# EAGLE schematic AnalogIn_Teensy_V10 (EAGLE 7.7.0)
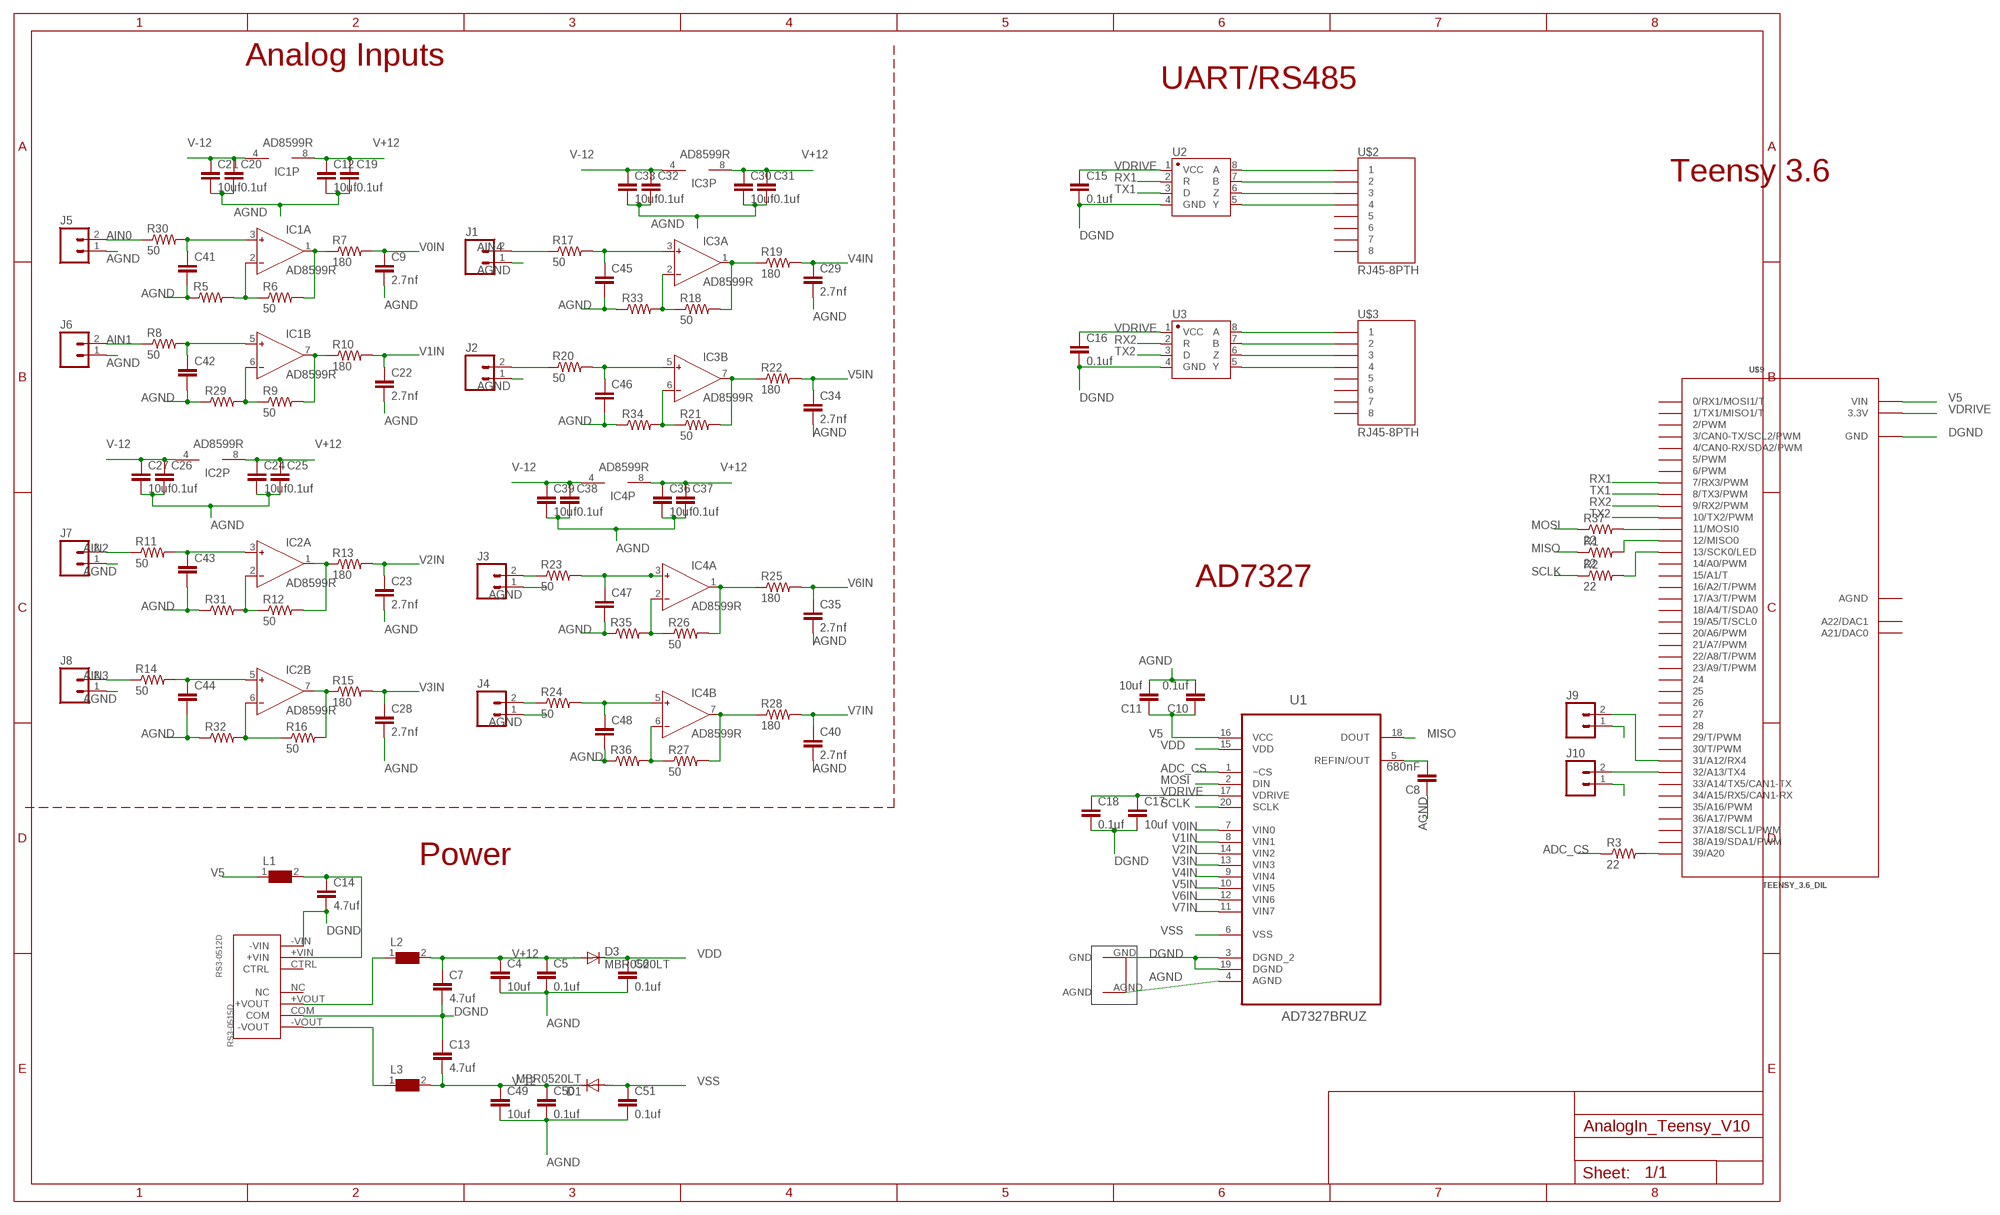
[diagram p0: schematic, sheet 1]

## Parts
C4  10uf  CAP0603-CAP  [0603-CAP]
C5  0.1uf  CAP0603-CAP  [0603-CAP]
C6  0.1uf  CAP0603-CAP  [0603-CAP]
C7  4.7uf  CAP0603-CAP  [0603-CAP]
C8  680nF  CAP0603-CAP  [0603-CAP]
C9  2.7nf  CAP0603-CAP  [0603-CAP]
C10  0.1uf  CAP0603-CAP  [0603-CAP]
C11  10uf  CAP0603-CAP  [0603-CAP]
C12  10uf  CAP0603-CAP  [0603-CAP]
C13  4.7uf  CAP0603-CAP  [0603-CAP]
C14  4.7uf  CAP0603-CAP  [0603-CAP]
C15  0.1uf  CAP0603-CAP  [0603-CAP]
C16  0.1uf  CAP0603-CAP  [0603-CAP]
C17  10uf  CAP0603-CAP  [0603-CAP]
C18  0.1uf  CAP0603-CAP  [0603-CAP]
C19  0.1uf  CAP0603-CAP  [0603-CAP]
C20  0.1uf  CAP0603-CAP  [0603-CAP]
C21  10uf  CAP0603-CAP  [0603-CAP]
C22  2.7nf  CAP0603-CAP  [0603-CAP]
C23  2.7nf  CAP0603-CAP  [0603-CAP]
C24  10uf  CAP0603-CAP  [0603-CAP]
C25  0.1uf  CAP0603-CAP  [0603-CAP]
C26  0.1uf  CAP0603-CAP  [0603-CAP]
C27  10uf  CAP0603-CAP  [0603-CAP]
C28  2.7nf  CAP0603-CAP  [0603-CAP]
C29  2.7nf  CAP0603-CAP  [0603-CAP]
C30  10uf  CAP0603-CAP  [0603-CAP]
C31  0.1uf  CAP0603-CAP  [0603-CAP]
C32  0.1uf  CAP0603-CAP  [0603-CAP]
C33  10uf  CAP0603-CAP  [0603-CAP]
C34  2.7nf  CAP0603-CAP  [0603-CAP]
C35  2.7nf  CAP0603-CAP  [0603-CAP]
C36  10uf  CAP0603-CAP  [0603-CAP]
C37  0.1uf  CAP0603-CAP  [0603-CAP]
C38  0.1uf  CAP0603-CAP  [0603-CAP]
C39  10uf  CAP0603-CAP  [0603-CAP]
C40  2.7nf  CAP0603-CAP  [0603-CAP]
C41  CAP0603-CAP  [0603-CAP]
C42  CAP0603-CAP  [0603-CAP]
C43  CAP0603-CAP  [0603-CAP]
C44  CAP0603-CAP  [0603-CAP]
C45  CAP0603-CAP  [0603-CAP]
C46  CAP0603-CAP  [0603-CAP]
C47  CAP0603-CAP  [0603-CAP]
C48  CAP0603-CAP  [0603-CAP]
C49  10uf  CAP0603-CAP  [0603-CAP]
C50  0.1uf  CAP0603-CAP  [0603-CAP]
C51  0.1uf  CAP0603-CAP  [0603-CAP]
D1  MBR0520LT  [SOD123]
D3  MBR0520LT  [SOD123]
IC1  AD8599R  [SO8]
IC2  AD8599R  [SO8]
IC3  AD8599R  [SO8]
IC4  AD8599R  [SO8]
J1  M023.5MM  [SCREWTERMINAL-3.5MM-2]
J2  M023.5MM  [SCREWTERMINAL-3.5MM-2]
J3  M023.5MM  [SCREWTERMINAL-3.5MM-2]
J4  M023.5MM  [SCREWTERMINAL-3.5MM-2]
J5  M023.5MM  [SCREWTERMINAL-3.5MM-2]
J6  M023.5MM  [SCREWTERMINAL-3.5MM-2]
J7  M023.5MM  [SCREWTERMINAL-3.5MM-2]
J8  M023.5MM  [SCREWTERMINAL-3.5MM-2]
J9  M023.5MM  [SCREWTERMINAL-3.5MM-2]
J10  M023.5MM  [SCREWTERMINAL-3.5MM-2]
L1  WE-CBF-742792118_1206  [1206]
L2  WE-CBF-742792118_1206  [1206]
L3  WE-CBF-742792118_1206  [1206]
R1  22  RESISTOR0603  [0603-RES]
R2  22  RESISTOR0603  [0603-RES]
R3  22  RESISTOR0603  [0603-RES]
R5  RESISTOR0603  [0603-RES]
R6  50  RESISTOR0603  [0603-RES]
R7  180  RESISTOR0603  [0603-RES]
R8  50  RESISTOR0603  [0603-RES]
R9  50  RESISTOR0603  [0603-RES]
R10  180  RESISTOR0603  [0603-RES]
R11  50  RESISTOR0603  [0603-RES]
R12  50  RESISTOR0603  [0603-RES]
R13  180  RESISTOR0603  [0603-RES]
R14  50  RESISTOR0603  [0603-RES]
R15  180  RESISTOR0603  [0603-RES]
R16  50  RESISTOR0603  [0603-RES]
R17  50  RESISTOR0603  [0603-RES]
R18  50  RESISTOR0603  [0603-RES]
R19  180  RESISTOR0603  [0603-RES]
R20  50  RESISTOR0603  [0603-RES]
R21  50  RESISTOR0603  [0603-RES]
R22  180  RESISTOR0603  [0603-RES]
R23  50  RESISTOR0603  [0603-RES]
R24  50  RESISTOR0603  [0603-RES]
R25  180  RESISTOR0603  [0603-RES]
R26  50  RESISTOR0603  [0603-RES]
R27  50  RESISTOR0603  [0603-RES]
R28  180  RESISTOR0603  [0603-RES]
R29  RESISTOR0603  [0603-RES]
R30  50  RESISTOR0603  [0603-RES]
R31  RESISTOR0603  [0603-RES]
R32  RESISTOR0603  [0603-RES]
R33  RESISTOR0603  [0603-RES]
R34  RESISTOR0603  [0603-RES]
R35  RESISTOR0603  [0603-RES]
R36  RESISTOR0603  [0603-RES]
R37  22  RESISTOR0603  [0603-RES]
RS3-0512D  RS3-0515D  [RS3-0515D]
U1  AD7327BRUZ  [SOP65P640X120-20N]
U2  SN65HVD31DR  [SO08]
U3  SN65HVD31DR  [SO08]
U$2  RJ45-8PTH  [RJ45-8]
U$3  RJ45-8PTH  [RJ45-8]
U$4  GNDPLANESHRT  [GNDPLANESHRT]
U$9  TEENSY_3.6_DIL  [TEENSY_3.6_DIL]

## Nets
+VOUT: L2.1 RS3-0512D.+VOUT
-VOUT: L3.1 RS3-0512D.-VOUT
ADC_CS: R3.1 U1.1(~CS)
AGND: C4.2 C5.2 C6.2 C8.1 C9.2 C10.2 C11.2 C12.2 C19.2 C20.2 C21.2 C22.2 C23.2 C24.2 C25.2 C26.2 C27.2 C28.2 C29.2 C30.2 C31.2 C32.2 C33.2 C34.2 C35.2 C36.2 C37.2 C38.2 C39.2 C40.2 C41.2 C42.2 C43.2 C44.2 C45.2 C46.2 C47.2 C48.2 C49.2 C50.2 C51.2 J1.1 J2.1 J3.1 J4.1 J5.1 J6.1 J7.1 J8.1 R5.1 R29.1 R31.1 R32.1 R33.1 R34.1 R35.1 R36.1 U1.4(AGND) U$4.AGND
AIN0: J5.2 R30.1
AIN1: J6.2 R8.1
AIN2: J7.2 R11.1
AIN3: J8.2 R14.1
AIN4: J1.2 R17.1
AIN5: J2.2 R20.1
AIN6: J3.2 R23.1
AIN7: J4.2 R24.1
DGND: C7.2 C13.1 C14.2 C15.2 C16.2 C17.2 C18.2 J9.1 J10.1 RS3-0512D.-VIN RS3-0512D.COM U1.3(DGND_2) U1.19(DGND) U2.4(GND) U3.4(GND) U$4.GND U$9.GND U$9.GND1(GND)
MISO: R1.1 U1.18(DOUT)
MOSI: R37.1 U1.2(DIN)
N$1: U2.6(Z) U$2.3
N$3: U2.8(A) U$2.1
N$4: U2.5(Y) U$2.4
N$5: U2.7(B) U$2.2
N$6: U3.6(Z) U$3.3
N$7: U3.5(Y) U$3.4
N$8: U3.8(A) U$3.1
N$9: U3.7(B) U$3.2
N$10: R37.2 U$9.11(11/MOSI0)
N$11: R1.2 U$9.12(12/MISO0)
N$12: C14.1 L1.2 RS3-0512D.+VIN
N$13: R3.2 U$9.39/A20
N$14: C41.1 IC1.3(A:IN+) R30.2
N$15: R2.2 U$9.13(13/SCK0/LED)
N$16: IC1.2(A:IN-) R5.2 R6.1
N$17: IC1.1(A:OUT) R6.2 R7.1
N$18: J9.2 U$9.31/A12(31/A12/RX4)
N$19: J10.2 U$9.32/A13(32/A13/TX4)
N$20: C42.1 IC1.5(B:IN+) R8.2
N$21: IC1.6(B:IN-) R9.1 R29.2
N$22: IC1.7(B:OUT) R9.2 R10.1
N$23: C43.1 IC2.3(A:IN+) R11.2
N$24: IC2.2(A:IN-) R12.1 R31.2
N$25: IC2.1(A:OUT) R12.2 R13.1
N$28: C44.1 IC2.5(B:IN+) R14.2
N$29: IC2.6(B:IN-) R16.1 R32.2
N$30: IC2.7(B:OUT) R15.1 R16.2
N$31: C45.1 IC3.3(A:IN+) R17.2
N$32: IC3.2(A:IN-) R18.1 R33.2
N$33: IC3.1(A:OUT) R18.2 R19.1
N$36: C46.1 IC3.5(B:IN+) R20.2
N$37: IC3.6(B:IN-) R21.1 R34.2
N$38: IC3.7(B:OUT) R21.2 R22.1
N$39: C47.1 IC4.3(A:IN+) R23.2
N$40: IC4.2(A:IN-) R26.1 R35.2
N$41: IC4.1(A:OUT) R25.1 R26.2
N$44: C48.1 IC4.5(B:IN+) R24.2
N$45: IC4.6(B:IN-) R27.1 R36.2
N$46: IC4.7(B:OUT) R27.2 R28.1
REF: C8.2 U1.5(REFIN/OUT)
RX1: U2.2(R) U$9.7(7/RX3/PWM)
RX2: U3.2(R) U$9.9(9/RX2/PWM)
SCLK: R2.1 U1.20(SCLK)
TX1: U2.3(D) U$9.8(8/TX3/PWM)
TX2: U3.3(D) U$9.10(10/TX2/PWM)
V0IN: C9.1 R7.2 U1.7(VIN0)
V1IN: C22.1 R10.2 U1.8(VIN1)
V2IN: C23.1 R13.2 U1.14(VIN2)
V3IN: C28.1 R15.2 U1.13(VIN3)
V4IN: C29.1 R19.2 U1.9(VIN4)
V5: C10.1 C11.1 L1.1 U1.16(VCC) U$9.VIN
V5IN: C34.1 R22.2 U1.10(VIN5)
V6IN: C35.1 R25.2 U1.12(VIN6)
V7IN: C40.1 R28.2 U1.11(VIN7)
V+12: C4.1 C5.1 C7.1 C12.1 C19.1 C24.1 C25.1 C30.1 C31.1 C36.1 C37.1 D3.A IC1.8(P:V+) IC2.8(P:V+) IC3.8(P:V+) IC4.8(P:V+) L2.2
V-12: C13.2 C20.1 C21.1 C26.1 C27.1 C32.1 C33.1 C38.1 C39.1 C49.1 C50.1 D1.C IC1.4(P:V-) IC2.4(P:V-) IC3.4(P:V-) IC4.4(P:V-) L3.2
VDD: C6.1 D3.C U1.15(VDD)
VDRIVE: C15.1 C16.1 C17.1 C18.1 U1.17(VDRIVE) U2.1(VCC) U3.1(VCC) U$9.3.3V U$9.3.3V3(3.3V)
VSS: C51.1 D1.A U1.6(VSS)
Unconnected: RS3-0512D.CTRL RS3-0512D.NC U$2.5 U$2.6 U$2.7 U$2.8 U$3.5 U$3.6 U$3.7 U$3.8 U$9.0(0/RX1/MOSI1/T) U$9.1(1/TX1/MISO1/T) U$9.2(2/PWM) U$9.3(3/CAN0-TX/SCL2/PWM) U$9.4(4/CAN0-RX/SDA2/PWM) U$9.5(5/PWM) U$9.6(6/PWM) U$9.14/A0(14/A0/PWM) U$9.15/A1(15/A1/T) U$9.16/A2(16/A2/T/PWM) U$9.17/A3(17/A3/T/PWM) U$9.18/A4(18/A4/T/SDA0) U$9.19/A5(19/A5/T/SCL0) U$9.20/A6(20/A6/PWM) U$9.21/A7(21/A7/PWM) U$9.22/A8(22/A8/T/PWM) U$9.23/A9(23/A9/T/PWM) U$9.24 U$9.25 U$9.26 U$9.27 U$9.28 U$9.29(29/T/PWM) U$9.30(30/T/PWM) U$9.33/A14(33/A14/TX5/CAN1-TX) U$9.34/A15(34/A15/RX5/CAN1-RX) U$9.35/A16(35/A16/PWM) U$9.36/A17(36/A17/PWM) U$9.37/A18(37/A18/SCL1/PWM) U$9.38/A19(38/A19/SDA1/PWM) U$9.A21(A21/DAC0) U$9.A22(A22/DAC1)

## Notes on the sheet
- Analog Inputs
- UART/RS485
- Teensy 3.6
- AD7327
- Power

## Power pins joined to a net without a drawn wire
AGND: U$9.AGND

## Library data of the parts
C4-C51 = SparkFun-Capacitors:CAP: Capacitor Standard 0603 ceramic capacitor, and 0.1" leaded capacitor.
D1 D3 = diode:MBR0520LT: SCHOTTKY BARRIER RECTIFIER Source: http://onsemi.com .. MBR0520LT1-D.pdf
IC1-IC4 = analog-devices:AD8599: Single and Dual, Ultralow Distortion, Ultralow Noise Op Amps Source: http://www.analog.com/static/imported-files/data_sheets/AD8597_8599.pdf; MPN: AD8599ARZ; OC_FARNELL: 1438872; OC_NEWARK: 34M5072
J1-J10 = SparkFun-Connectors:M02: Standard 2-pin 0.1" header. Use with - straight break away headers ( PRT-00116) - right angle break away headers (PRT-00553) - swiss pins (PRT-00743) - machine pins (PRT-00117) - female headers (PRT-00115) Molex polarized connector foot print use with: PRT-08233 with associated crimp pins and housings. 2.54_SCREWTERM for use with PRT-10571. 3.5mm Screw Terminal footprints for PRT-08084 5mm Screw Terminal footprints for use with PRT-08432; PROD_ID: CONN-08399
L1-L3 = WE-CBF:WE-CBF: SMD EMI Suppression Ferrite Beads WE-CBF - Excellent anti-EMI properties - Low DC-restistance - Impedances till 3000 ohms - Rated current up to 6 A -- Reliable Ni-Sn electrodes -- Perfect as data lined filter and for uncoupling of distribution voltage; MPN: 742792118; OC_FARNELL: 1800374; OC_NEWARK: 78R5648; PACKAGE: IND-1206; SUPPLIER: Wuerth Elektronik
R1-R3 R5-R37 = SparkFun-Resistors:RESISTOR: Resistor Basic schematic elements and footprints for 0603, 1206, and PTH resistors.
RS3-0512D = JoshParts10:RS3-0515D
U1 = AD7327BRUZ:AD7327BRUZ: 500 kSPS, 8-Channel, Software-Selectable, True Bipolar Input, 12-Bit Plus Sign ADC; MPN: AD7327BRUZ; OC_FARNELL: 1274245; OC_NEWARK: 19M0860; PACKAGE: TSSOP-20; SUPPLIER: Analog devices
U2 U3 = Joshparts4:SN65HVD31DR: A placeholder for generic narrow & wide SOIC8 foorptints - used on the DIP adapter board.
U$2 U$3 = SparkFun:RJ45-8: RJ45 Jack Simple RJ45, 8-pin connection - connector for common Cat5, Cat5e, and Cat6 Ethernet cables. Footprint not yet proven in production. Connector sku is PRT-00643; Breakout PCB sku is BOB-00716.
U$4 = Joshparts2:GNDPLANESHRT
U$9 = Teensy_3_and_LC_Series_Boards_v1.4:TEENSY_3.6_DIL: Teensy 3.6 DIL Package